# Altium project DB32.PRJPCB
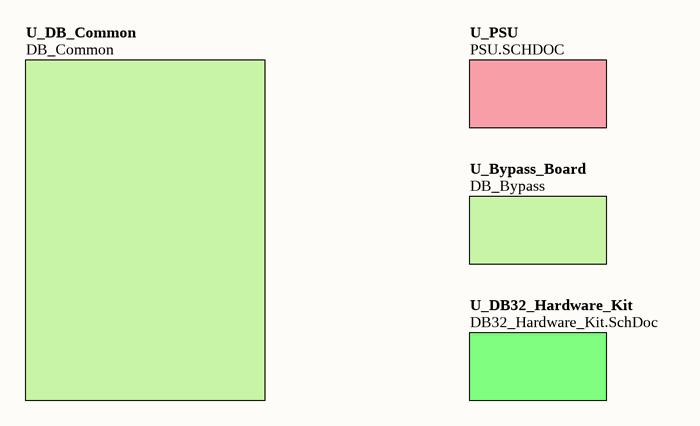
[diagram p0: DB32_Top.SchDoc]
ProjectAddress1: L3, 12A Rodborough Road; ProjectAddress2: Frenchs Forest; ProjectAddress3: NSW 2086; ProjectAddress4: Australia; ProjectAssyNum: D-820-0006; ProjectOrganization: Altium Limited; ProjectRevision: 08; ProjectTitle: DB32 - Daughter Board Lattice; ProjectTotalSheets: 19
5 sheets, 33 parts. Net scope: hierarchical (ports join the sheet entries above them; power ports are global).
Board files: DB32.PcbDoc, DB32_Panel.PcbDoc
Sheets:
  DB32_Top.SchDoc
    U_PSU = PSU.SCHDOC
    U_DB32_Hardware_Kit = DB32_Hardware_Kit.SchDoc
  DEVICES.SchDoc
  Bypass_FPGA_1V2.SCHDOC

## Sheet DB32_Top.SchDoc: DB32 Top Level
size A4; Organization: Altium Limited.; Address1: Level 3, 12a Rodborough Rd; Address2: Frenchs Forest 2086; Address3: NSW; Address4: AUSTRALIA; DocumentNumber: 1; SheetNumber: 2; SheetTotal: 21

### Sub-sheets
U_Bypass_Board = DB_Bypass (file not in this document): no entries
U_DB32_Hardware_Kit = DB32_Hardware_Kit.SchDoc: no entries
U_DB_Common = DB_Common (file not in this document): no entries
U_PSU = PSU.SCHDOC: no entries

### Notes on the sheet
- Sheet Title
- Project Title
- Size:
- Date:
- A4
- Assy:
- Time:
- Revision:
- Sheet
- of
- File:

## Sheet PSU.SCHDOC: Power Supply Top Level
size A4; Organization: Altium Limited.; Address1: Level 3, 12a Rodborough Rd; Address2: Frenchs Forest 2086; Address3: NSW; Address4: AUSTRALIA; DocumentNumber: 9; SheetNumber: 9; SheetTotal: 21
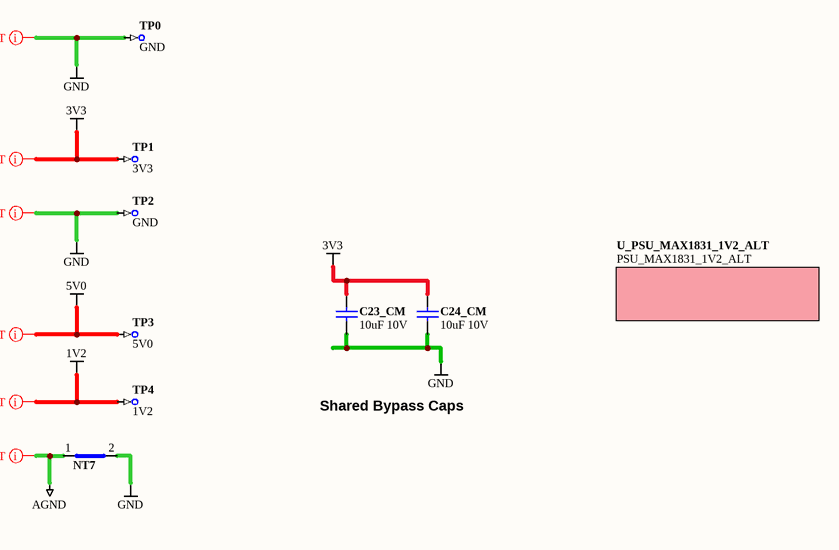
[diagram p1: PSU.SCHDOC]

### Parts
C23_CM  10uF 10V  [CAPC2012-STAR]
C24_CM  10uF 10V  [CAPC2012-STAR]
NT7  Net Tie SMT2  [NETTIE-SMT2-8X8]  (value not drawn)  (net tie, no BOM)
TP0  GND  [TestPin]  (no BOM)
TP1  3V3  [TestPin]  (no BOM)
TP2  GND  [TestPin]  (no BOM)
TP3  5V0  [TestPin]  (no BOM)
TP4  1V2  [TestPin]  (no BOM)

### Sub-sheets
U_PSU_MAX1831_1V2_ALT = PSU_MAX1831_1V2_ALT (file not in this document): no entries

### Nets
1V2: TP4.1
3V3: C23_CM.1 C24_CM.1 TP1.1
5V0: TP3.1
AGND: NT7.1(Net1)
GND: C23_CM.2 C24_CM.2 NT7.2(Net2) TP0.1 TP2.1

### Layout directives
net class PWRNET: 1V2, 3V3, 5V0, AGND, GND

### Notes on the sheet
- Shared Bypass Caps
- Sheet Title
- Project Title
- Size:
- Date:
- A4
- Assy:
- Time:
- Revision:
- Sheet
- of
- File:

### Library data of the parts
C23_CM C24_CM = D-101-0087: Capacitor, Ceramic, 10uF 10% 10V 0805 (2012) X5R; Polarity: Non-Polarized; Capacitance: 10 uF; Dielectric: X5R; Mounting Technology: Surface Mount; Rated Voltage: 10 V; Status: Unreleased; Technology: None; Tolerance: 10 %; Category: Capacitor
NT7 = D-002-0002: Net-Tie, Surface Mount, 2 x 0.4mm x 0.2mm SMT Pads - For 0.2mm Track; Status: Production; Category: Net-Tie
TP0-TP4 = D-006-0000: Test Point, PCB Mount with Silkscreen Box; Status: Production; Category: Test-Point

## Sheet DB32_Hardware_Kit.SchDoc: DB32 Hardware Kit
size A4; Organization: Altium Limited.; Address1: Level 3, 12a Rodborough Rd; Address2: Frenchs Forest 2086; Address3: NSW; Address4: AUSTRALIA; DocumentNumber: 8; SheetNumber: 8; SheetTotal: 21
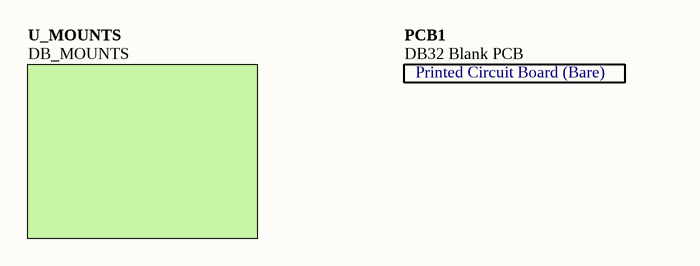
[diagram p2: DB32_Hardware_Kit.SchDoc]

### Parts
PCB1  DB32 Blank PCB  (mechanical)

### Sub-sheets
U_MOUNTS = DB_MOUNTS (file not in this document): no entries

### Notes on the sheet
- Sheet Title
- Project Title
- Size:
- Date:
- A4
- Assy:
- Time:
- Revision:
- Sheet
- of
- File:
- (in symbol D-810-0006) Printed Circuit Board (Bare)

### Library data of the parts
PCB1 = D-810-0006: DB32 Blank PCB - Daughter Board Lattice ECP LFECP33E-3FN672C; ProjectPath: DB32.PrjPCB; Status: Unreleased; Category: Blank PCB

## Sheet DEVICES.SchDoc: FPGA, LEDs and SRAM Memory
size A4; Organization: Altium Limited.; Address1: Level 3, 12a Rodborough Rd; Address2: Frenchs Forest 2086; Address3: NSW; Address4: AUSTRALIA; DocumentNumber: 2; SheetNumber: 3; SheetTotal: 21
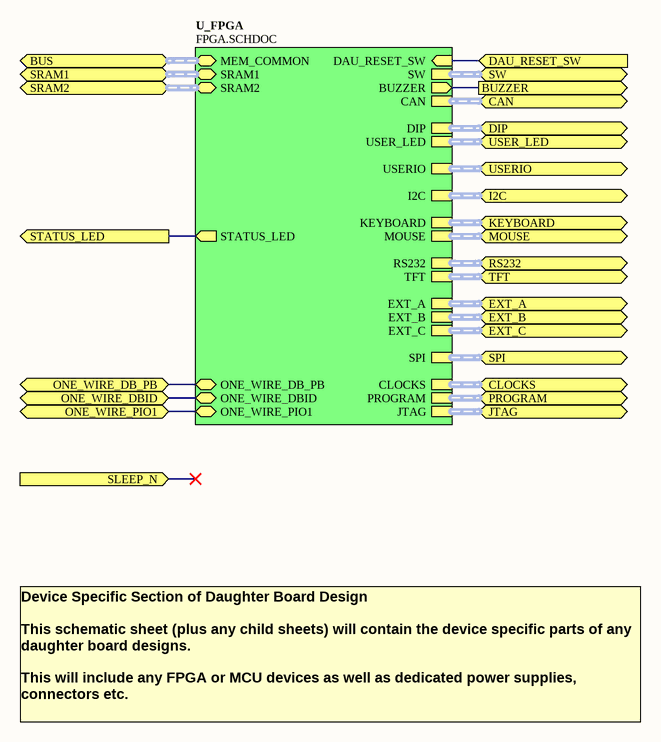
[diagram p3: DEVICES.SchDoc]

### Sub-sheets
U_FPGA = FPGA.SCHDOC (file not in this document): SRAM1 (harness SRAM-256Kx16), SRAM2 (harness SRAM-256Kx16), MEM_COMMON (harness HOSTMEMORY), DAU_RESET_SW (in), BUZZER (out), ONE_WIRE_DBID (bidir), ONE_WIRE_DB_PB (bidir), ONE_WIRE_PIO1 (bidir), JTAG (harness HardSoft_JTAG), SW (harness SW5), DIP (harness SW8), USERIO (harness IO36), EXT_A (harness PBIO), EXT_B (harness PBIO), EXT_C (harness PBIO), USER_LED (harness LED8), SPI (harness DAU_SPI), I2C (harness I2C), CAN (harness CAN_INT), RS232 (harness RS232_INT), KEYBOARD (harness PS2), MOUSE (harness PS2), TFT (harness DAU_TFT), PROGRAM (harness DAU_CTRL), CLOCKS (harness DAU_CLK), STATUS_LED (out)

### Ports
BUS (harness HOSTMEMORY), BUZZER (out), CAN, CLOCKS, DAU_RESET_SW (in), DIP, EXT_A, EXT_B, EXT_C, I2C, JTAG, KEYBOARD, MOUSE, ONE_WIRE_DB_PB (bidir), ONE_WIRE_DBID (bidir), ONE_WIRE_PIO1 (bidir), PROGRAM, RS232, SLEEP_N (in), SPI, SRAM1, SRAM2 (harness SRAM-256Kx16), STATUS_LED (out), SW, TFT, USER_LED, USERIO

### Nets
BUZZER: port BUZZER, sheet U_FPGA/BUZZER
DAU_RESET_SW: port DAU_RESET_SW, sheet U_FPGA/DAU_RESET_SW
ONE_WIRE_DB_PB: port ONE_WIRE_DB_PB, sheet U_FPGA/ONE_WIRE_DB_PB
ONE_WIRE_DBID: port ONE_WIRE_DBID, sheet U_FPGA/ONE_WIRE_DBID
ONE_WIRE_PIO1: port ONE_WIRE_PIO1, sheet U_FPGA/ONE_WIRE_PIO1
STATUS_LED: port STATUS_LED, sheet U_FPGA/STATUS_LED

### Buses and harness runs
harness port BUS = sheet U_FPGA/MEM_COMMON
harness port CAN = sheet U_FPGA/CAN
harness port CLOCKS = sheet U_FPGA/CLOCKS
harness port DIP = sheet U_FPGA/DIP
harness port EXT_A = sheet U_FPGA/EXT_A
harness port EXT_B = sheet U_FPGA/EXT_B
harness port EXT_C = sheet U_FPGA/EXT_C
harness port I2C = sheet U_FPGA/I2C
harness port JTAG = sheet U_FPGA/JTAG
harness port KEYBOARD = sheet U_FPGA/KEYBOARD
harness port MOUSE = sheet U_FPGA/MOUSE
harness port PROGRAM = sheet U_FPGA/PROGRAM
harness port RS232 = sheet U_FPGA/RS232
harness port SPI = sheet U_FPGA/SPI
harness port SRAM1 = sheet U_FPGA/SRAM1
harness port SRAM2 = sheet U_FPGA/SRAM2
harness port SW = sheet U_FPGA/SW
harness port TFT = sheet U_FPGA/TFT
harness port USER_LED = sheet U_FPGA/USER_LED
harness port USERIO = sheet U_FPGA/USERIO

### Notes on the sheet
- Device Specific Section of Daughter Board Design
  This schematic sheet (plus any child sheets) will contain the device specific parts of any daughter board designs.
  This will include any FPGA or MCU devices as well as dedicated power supplies, connectors etc.
- Sheet Title
- Project Title
- Size:
- Date:
- A4
- Assy:
- Time:
- Revision:
- Sheet
- of
- File:

## Sheet Bypass_FPGA_1V2.SCHDOC: FPGA Bypass Capacitors for 1V2
size A4; Organization: Altium Limited.; Address1: Level 3, 12a Rodborough Rd; Address2: Frenchs Forest 2086; Address3: NSW; Address4: AUSTRALIA; DocumentNumber: 5; SheetNumber: 5; SheetTotal: 21
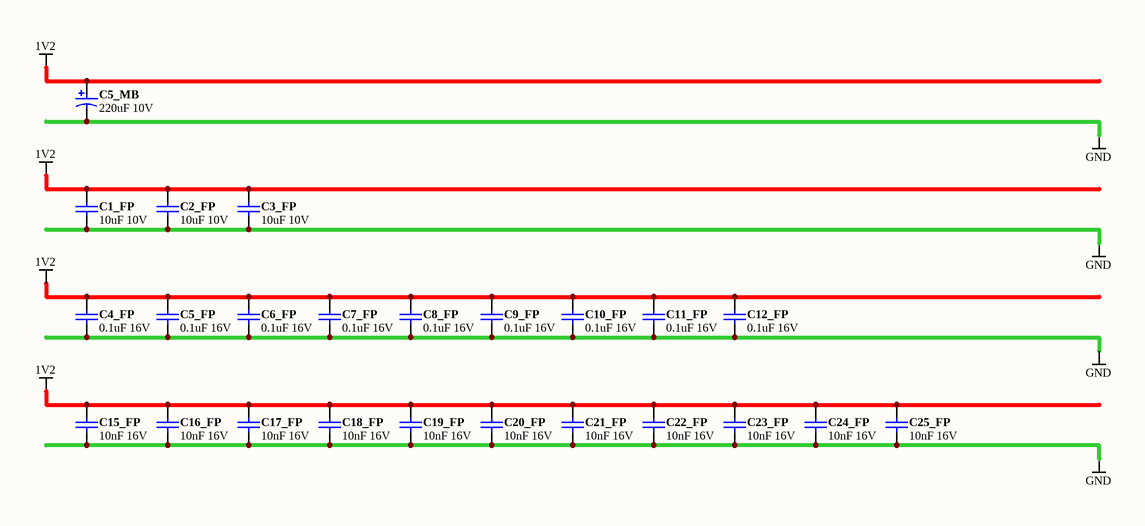
[diagram p4: Bypass_FPGA_1V2.SCHDOC]

### Parts
C1_FP  10uF 10V  [CAPC2012-STAR]
C2_FP  10uF 10V  [CAPC2012-STAR]
C3_FP  10uF 10V  [CAPC2012-STAR]
C4_FP  0.1uF 16V  [CAPC1005-STAR]
C5_FP  0.1uF 16V  [CAPC1005-STAR]
C5_MB  220uF 10V  [CAPC7343-STAR]
C6_FP  0.1uF 16V  [CAPC1005-STAR]
C7_FP  0.1uF 16V  [CAPC1005-STAR]
C8_FP  0.1uF 16V  [CAPC1005-STAR]
C9_FP  0.1uF 16V  [CAPC1005-STAR]
C10_FP  0.1uF 16V  [CAPC1005-STAR]
C11_FP  0.1uF 16V  [CAPC1005-STAR]
C12_FP  0.1uF 16V  [CAPC1005-STAR]
C15_FP  10nF 16V  [CAPC1005-STAR]
C16_FP  10nF 16V  [CAPC1005-STAR]
C17_FP  10nF 16V  [CAPC1005-STAR]
C18_FP  10nF 16V  [CAPC1005-STAR]
C19_FP  10nF 16V  [CAPC1005-STAR]
C20_FP  10nF 16V  [CAPC1005-STAR]
C21_FP  10nF 16V  [CAPC1005-STAR]
C22_FP  10nF 16V  [CAPC1005-STAR]
C23_FP  10nF 16V  [CAPC1005-STAR]
C24_FP  10nF 16V  [CAPC1005-STAR]
C25_FP  10nF 16V  [CAPC1005-STAR]

### Nets
1V2: C1_FP.1 C2_FP.1 C3_FP.1 C4_FP.1 C5_FP.1 C5_MB.1 C6_FP.1 C7_FP.1 C8_FP.1 C9_FP.1 C10_FP.1 C11_FP.1 C12_FP.1 C15_FP.1 C16_FP.1 C17_FP.1 C18_FP.1 C19_FP.1 C20_FP.1 C21_FP.1 C22_FP.1 C23_FP.1 C24_FP.1 C25_FP.1
GND: C1_FP.2 C2_FP.2 C3_FP.2 C4_FP.2 C5_FP.2 C5_MB.2 C6_FP.2 C7_FP.2 C8_FP.2 C9_FP.2 C10_FP.2 C11_FP.2 C12_FP.2 C15_FP.2 C16_FP.2 C17_FP.2 C18_FP.2 C19_FP.2 C20_FP.2 C21_FP.2 C22_FP.2 C23_FP.2 C24_FP.2 C25_FP.2

### Notes on the sheet
- Sheet Title
- Project Title
- Size:
- Date:
- A4
- Assy:
- Time:
- Revision:
- Sheet
- of
- File:

### Library data of the parts
C1_FP C2_FP C3_FP = D-101-0087: as C23_CM on sheet PSU; Capacitance: 10 uF; Dielectric: X5R; Mounting Technology: Surface Mount; Rated Voltage: 10 V; Status: Unreleased; Technology: None; Tolerance: 10 %; Category: Capacitor
C4_FP C5_FP C6_FP C7_FP C8_FP C9_FP C10_FP C11_FP C12_FP = D-101-0080: Capacitor, Ceramic, 0.1uF 10% 16V 0402 (1005) X7R; Polarity: Non-Polarized; Capacitance: 0.1 uF; Dielectric: X7R; Mounting Technology: Surface Mount; Rated Voltage: 16 V; Status: Production; Technology: Ceramic; Tolerance: 10 %; Category: Capacitor
C5_MB = D-101-0088: Capacitor, Tantalum, 220uF 10% 10V MCCT-D (7343-31); Polarity: Polarized; Capacitance: 220 uF; Mounting Technology: Surface Mount; Rated Voltage: 10 V; Status: Unreleased; Technology: Tantalum; Tolerance: 10 %; Category: Capacitor
C15_FP C16_FP C17_FP C18_FP C19_FP C20_FP C21_FP C22_FP C23_FP C24_FP C25_FP = D-101-0077: Capacitor, Ceramic, 10nF 10% 16V 0402 (1005) X7R; Polarity: Non-Polarized; Capacitance: 10 nF; Dielectric: X7R; Mounting Technology: Surface Mount; Rated Voltage: 16 V; Status: Production; Technology: Ceramic; Tolerance: 10 %; Category: Capacitor

## Nets that join several sheets
1V2: PSU (TP4.1), Bypass_FPGA_1V2 (24 pins)
GND: PSU (5 pins), Bypass_FPGA_1V2 (24 pins)

## Assembly variants
Production: not fitted RN1 RN2 RN3 RN4 RN5 RN6 RN7 RN8 RN17 RN18 RN19 RN20 RN21 RN22 RN23 RN24 RN25 RN26 RN27 RN28 RN29 RN30 RN31 RN32